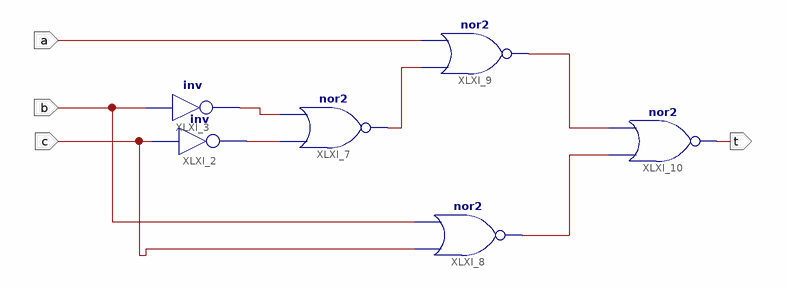
[diagram p0: schematic sheet 1]
// Xilinx ISE schematic TP22.sch (spartan3e) as structural Verilog: 6 symbols, 4 ports
module TP22 (
  input  a,
  input  b,
  input  c,
  output t
);

  wire XLXN_1, XLXN_2, XLXN_3, XLXN_5, XLXN_6;

  not XLXI_2 (XLXN_6, c);
  not XLXI_3 (XLXN_5, b);
  nor XLXI_7 (XLXN_1, XLXN_6, XLXN_5);
  nor XLXI_8 (XLXN_2, c, b);
  nor XLXI_9 (XLXN_3, XLXN_1, a);
  nor XLXI_10 (t, XLXN_2, XLXN_3);
endmodule
